# Altium schematic sheet Sheet1.SchDoc
size A4
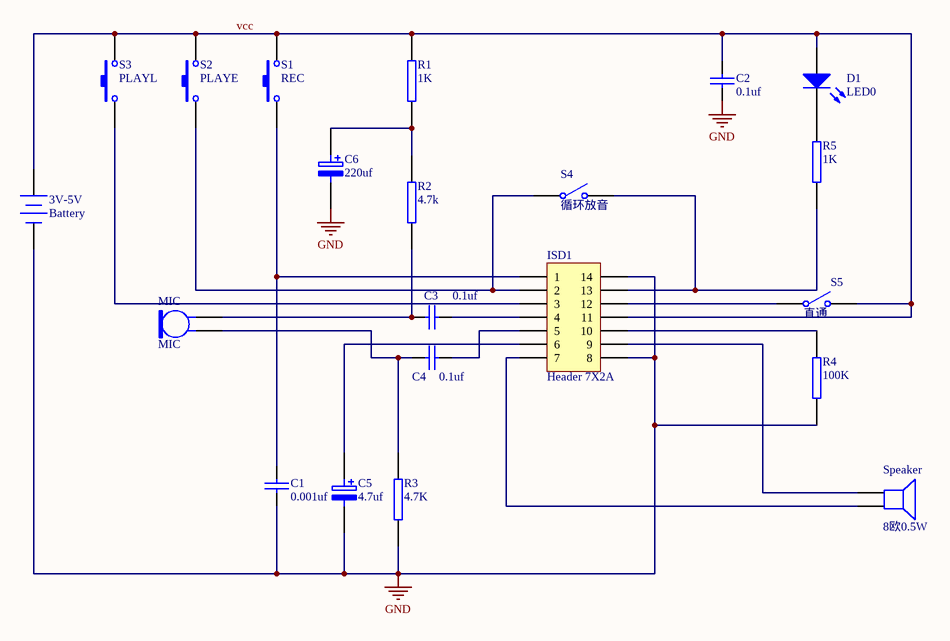
[diagram p0: Sheet1.SchDoc]

## Parts
3V-5V  Battery  [BAT-2]
C1  0.001uf  [RAD4]
C2  0.1uf  [RAD4]
C3  0.1uf  [RAD4]
C4  0.1uf  [RAD4]
C5  4.7uf  [RB5/8]
C6  220uf  [RB5/8]
D1  LED0  [LED-0]
ISD1  Header 7X2A  [DIP14]
MIC  MIC  [PIN2]
R1  1K  [AXIAL0.4]
R2  4.7k  [AXIAL0.4]
R3  4.7K  [AXIAL0.4]
R4  100K  [AXIAL0.4]
R5  1K  [AXIAL0.4]
S1  REC  [SPST-2]
S2  PLAYE  [SPST-2]
S3  PLAYL  [SPST-2]
S4  循环放音  [SPST-2]
S5  直通  [SPST-2]
Speaker  8欧0.5W  [PIN2]

## Nets
GND: 3V-5V.2(-) C1.2 C2.2 C5.2 C6.2 ISD1.8 ISD1.14 R3.2 R4.1
vcc: 3V-5V.1(+) C2.1 D1.1(A) ISD1.11 R1.2 S1.2 S2.2 S3.2 S5.2(NO)
NetC1_1: C1.1 ISD1.1 S1.1
NetC3_1: C3.1 ISD1.4
NetC3_2: C3.2 MIC.2 R2.1
NetC4_1: C4.1 MIC.1 R3.1
NetC4_2: C4.2 ISD1.5
NetC5_1: C5.1 ISD1.6
NetC6_1: C6.1 R1.1 R2.2
NetD1_2: D1.2(K) R5.2
NetISD1_2: ISD1.2 S2.1 S4.1(COMMON)
NetISD1_3: ISD1.3 S3.1
NetISD1_7: ISD1.7 Speaker.2
NetISD1_9: ISD1.9 Speaker.1
NetISD1_10: ISD1.10 R4.2
NetISD1_12: ISD1.12 S5.1(COMMON)
NetISD1_13: ISD1.13 R5.1 S4.2(NO)

## Library data of the parts
3V-5V = Battery: Multicell Battery; Published: 24-Mar-1999; LatestRevisionDate: 17-Jul-2002; LatestRevisionNote: Re-released for DXP Platform.; PackageReference: BAT-2; Publisher: Altium Limited; PackageDescription: Battery; 2 Leads
C1-C4 = CAP: Capacitor
C5 C6 = ELECTRO2: Electrolytic Capacitor
D1 = LED0: Typical INFRARED GaAs LED; Published: 8-Jun-2000; LatestRevisionDate: 08-Jul-2005; LatestRevisionNote: Mech Layer 1 removed.; PackageReference: LED-0; Publisher: Altium Limited; PackageDescription: LED; 2 Leads
ISD1 = Header 7X2A: Header, 7-Pin, Dual row; LatestRevisionDate: 17-Jul-2002; LatestRevisionNote: Re-released for DXP Platform.; Publisher: Altium Limited
MIC = Mic2: Microphone; Published: 24-Mar-1999; LatestRevisionDate: 17-Jul-2002; LatestRevisionNote: Re-released for DXP Platform.; PackageReference: PIN2; Publisher: Altium Limited
R1-R5 = RES2
S1-S3 = SW-PB: Switch; Published: 24-Mar-1999; LatestRevisionDate: 17-Jul-2002; LatestRevisionNote: Re-released for DXP Platform.; PackageReference: SPST-2; Publisher: Altium Limited; PackageDescription: Switch; 2 Leads
S4 S5 = SW-SPST: Single-Pole, Single-Throw Switch; Published: 24-Mar-1999; LatestRevisionDate: 17-Jul-2002; LatestRevisionNote: Re-released for DXP Platform.; PackageReference: SPST-2; Publisher: Altium Limited; PackageDescription: Switch; 2 Leads
Speaker = Speaker: Loudspeaker; Published: 24-Mar-1999; LatestRevisionDate: 17-Jul-2002; LatestRevisionNote: Re-released for DXP Platform.; PackageReference: PIN2; Publisher: Altium Limited